# EAGLE design LeoPager (EAGLE 8.3.2)
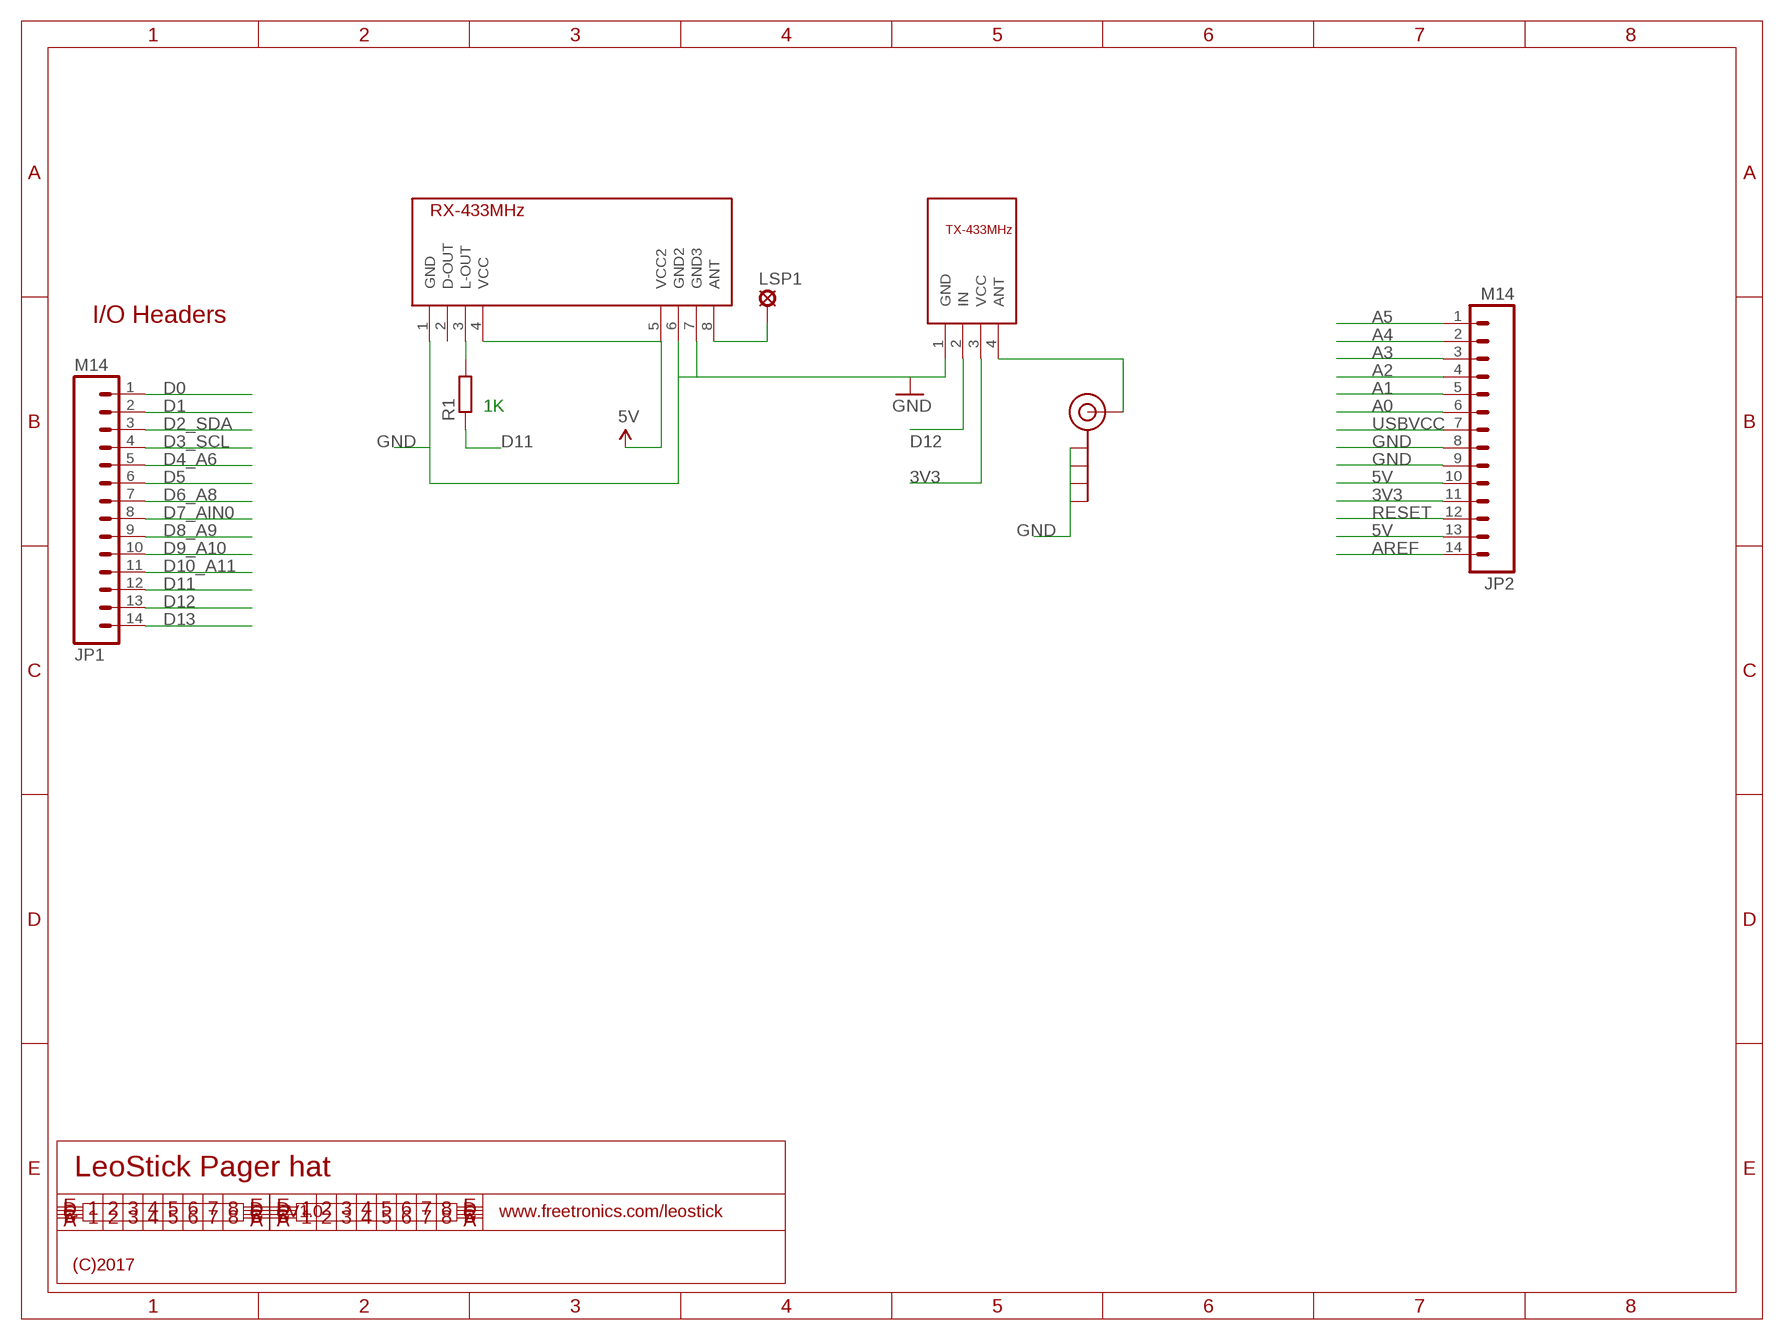
[diagram p0: schematic, sheet 1]

## Parts
J$1  SMA_EDGE  [SMA-EDGE]
JP1  M14  [1X14]
JP2  M14  [1X14]
LSP1  LSP10  [LSP10]
R1  R-EU_0204/7  [0204/7]
RF-MODULE1  RX-433MHZ  [RX-433MHZ]
RF-MODULE2  TX-433MHZ  [TX-433MHZ]

## Nets
3V3: JP2.11 RF-MODULE2.3(VCC)
5V: JP2.10 JP2.13 RF-MODULE1.4(VCC) RF-MODULE1.5(VCC2)
A0: JP2.6
A1: JP2.5
A2: JP2.4
A3: JP2.3
A4: JP2.2
A5: JP2.1
AREF: JP2.14
D0: JP1.1
D1: JP1.2
D2_SDA: JP1.3
D3_SCL: JP1.4
D4_A6: JP1.5
D5: JP1.6
D6_A8: JP1.7
D7_AIN0: JP1.8
D8_A9: JP1.9
D9_A10: JP1.10
D10_A11: JP1.11
D11: JP1.12 R1.1
D12: JP1.13 RF-MODULE2.2(IN)
D13: JP1.14
GND: J$1.GND@0(GND) J$1.GND@1(GND) J$1.GND@2(GND) J$1.GND@3(GND) JP2.8 JP2.9 RF-MODULE1.1(GND) RF-MODULE1.6(GND2) RF-MODULE1.7(GND3) RF-MODULE2.1(GND)
N$1: R1.2 RF-MODULE1.3(L-OUT)
N$2: J$1.SIG(SIGNAL) RF-MODULE2.4(ANT)
N$4: LSP1.MP RF-MODULE1.8(ANT)
RESET: JP2.12
USBVCC: JP2.7
Unconnected: RF-MODULE1.2(D-OUT)

## Notes on the sheet
- I/O Headers
- 1K
- LeoStick Pager hat
- . | V1.0 | www.freetronics.com/leostick
- (C)2017

## Library data of the parts
J$1 = SparkFun:SMA_EDGE: SMA Antenna Connector End launch SMA connector. The paste layer has been removed so that the connector can be hand soldered onto the board after reflow.
JP1 JP2 = freetronics-jon:M14: Header 14 Standard 14-pin 0.1" header. Use with straight break away headers (SKU : PRT-00116), right angle break away headers (PRT-00553), swiss pins (PRT-00743), machine pins (PRT-00117), and female headers (PRT-00115).
LSP1 = solpad:LSP10: SOLDER PAD drill 1.0 mm, distributor Buerklin, 12H555
R1 = resistor:R-EU_: RESISTOR, European symbol
RF-MODULE1 = LeoPager:RX-433MHZ: TX-433Mhz Receiver Module 433.92MHz
RF-MODULE2 = LeoPager:TX-433MHZ: TX-433Mhz Transmitter Module 433.92Mhz

## Net classes
0 default: width 0.152 mm, drill 0.241 mm, clearance 0.152 mm

## Board
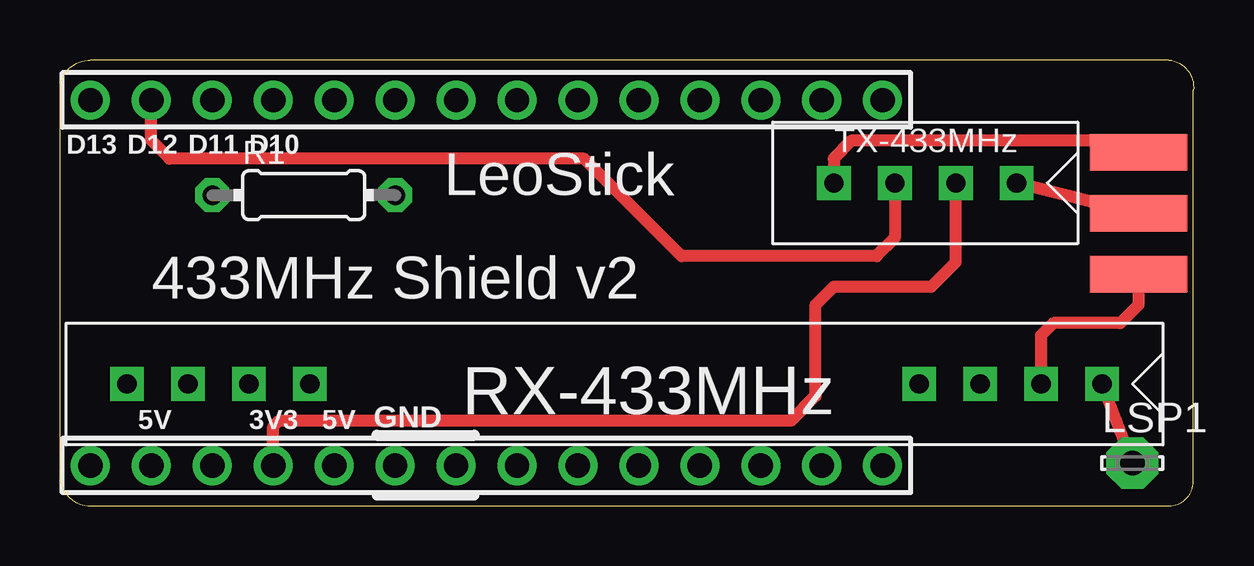
[diagram p1: board, top side]
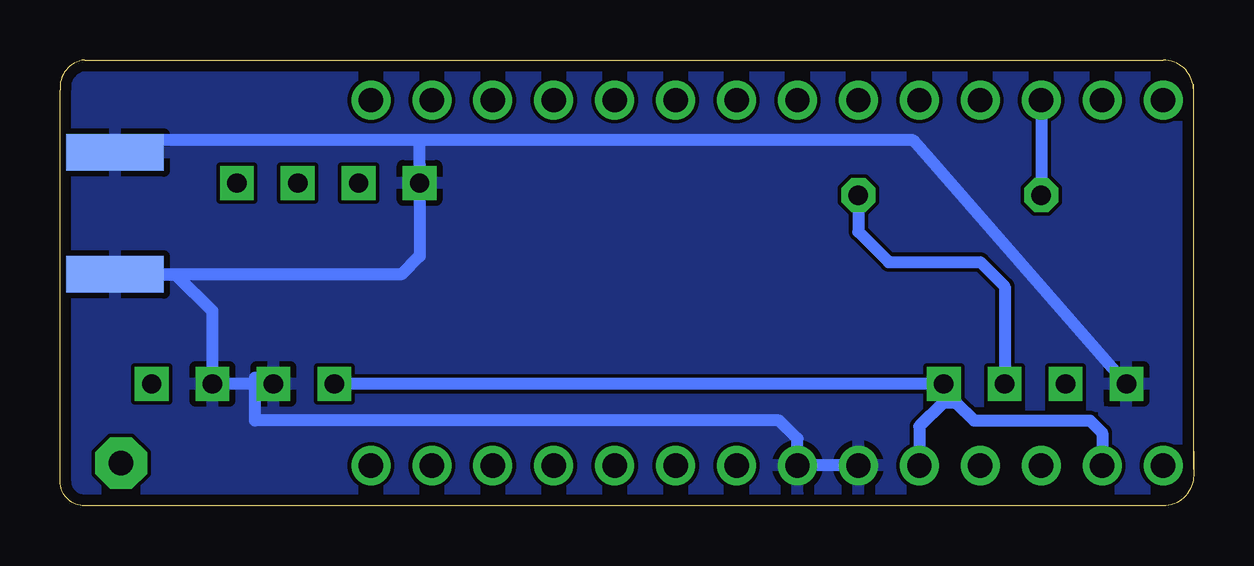
[diagram p2: board, bottom side, seen from below]

Size 47.25 x 18.59 mm. Coordinates in mm from the lower left corner, seen from the top.
Outline: 0,2.28 0,1.52
Outline: 0,1.52 0,1.27 arc90 1.27,0 46.23,0 arc90 47.24,1.02 47.24,17.32 arc90 46.23,18.59 1.27,18.59 arc90 0,17.32 0,16.32
Outline: 0,1.52 0,17.58
Copper layers (1*16): Top 0.035mm / dielectric 1.5mm / Bottom 0.035mm
Design rules "default *": minimum track width 6mil, minimum drill 9.5mil, track to track 6mil, track to pad 6mil, pad to pad 6mil, via to via 6mil, smd to smd 6mil, copper to edge 18mil, drill to drill 8mil, minimum pad ring 12mil, minimum via ring 4mil, stop-mask expansion 2mil, vias tented up to drill 25mil, thermal gap 10mil

### Footprints (pad centres in the part's own frame; a part is rotated, then mirrored left to right if it is on the bottom)
SMA-EDGE = smd 1.524 x 4.064: GND@0 0,0; GND@1 5.08,0; SIG 2.54,0 | smd 1.524 x 4.064 bottom: GND@2 0,0; GND@3 5.08,0
1X14 = drill 1.016: 1 0,0; 2 2.54,0; 3 5.08,0; 4 7.62,0; 5 10.16,0; 6 12.7,0; 7 15.24,0; 8 17.78,0; 9 20.32,0; 10 22.86,0; 11 25.4,0; 12 27.94,0; 13 30.48,0; 14 33.02,0
LSP10 = drill 1.016 pad 2.159 octagon: MP 0,0
0204/7 = drill 0.813 octagon: 1 -3.81,0; 2 3.81,0
RX-433MHZ = drill 0.8 square: 1 0,1.27; 2 2.54,1.27; 3 5.08,1.27; 4 7.62,1.27; 5 33.02,1.27; 6 35.56,1.27; 7 38.1,1.27; 8 40.64,1.27
TX-433MHZ = drill 0.8 square: 1 1.27,1.27; 2 3.81,1.27; 3 6.35,1.27; 4 8.89,1.27

### Placement (x,y rotation side)
J$1  44.96,9.65 90 top
JP1  34.29,16.92 180 top
JP2  34.29,1.68 180 top
LSP1  44.7,1.78 0 top
R1  10.16,12.95 0 top
RF-MODULE1  2.79,3.81 0 top
RF-MODULE2  30.99,12.19 0 top

### Tracks (layer width: path | path; a pad name or v marks a point on that pad's centre or on a via)
3V3
  Top 0.508: JP2.11 8.89,3.3 9.14,3.56 30.48,3.56 31.5,4.57 31.5,8.38 32.26,9.14 36.32,9.14 37.34,10.16 RF-MODULE2.3
5V
  Bottom 0.508: 10.41,4.32 RF-MODULE1.4 RF-MODULE1.5 | 10.41,4.32 11.43,3.3 JP2.10 | 10.41,4.32 9.91,4.32 9.14,3.56 4.32,3.56 3.81,3.05 JP2.13
D11
  Bottom 0.508: JP1.12 R1.1
D12
  Top 0.508: RF-MODULE2.2 34.8,11.18 34.04,10.41 25.91,10.41 21.84,14.48 4.57,14.48 3.81,15.24 JP1.13
GND
  Top 0.152: 44.96,9.6 J$1.GND@2 | RF-MODULE1.7 40.95,5.84 | 44.45,15.24 J$1.GND@3
  Top 0.508: J$1.GND@2 44.96,8.38 44.2,7.62 41.4,7.62 40.89,7.11 RF-MODULE1.7 | RF-MODULE2.1 32.26,14.48 33.02,15.24 44.45,15.24
  Bottom 0.152: 44.45,15.24 J$1.GND@3
  Bottom 0.508: 32.26,15.24 32.26,14.22 RF-MODULE2.1 32.26,10.41 33.02,9.65 J$1.GND@2 42.42,9.65 40.89,8.13 RF-MODULE1.7 RF-MODULE1.6 39.12,5.33 39.12,3.56 17.27,3.56 16.51,2.79 JP2.8 JP2.9 | RF-MODULE1.1 11.68,15.24 32.26,15.24 | 32.26,15.24 44.45,15.24
  pour Bottom: -1.02,19.3 -1.02,-0.76 -0.76,-1.02 46.48,-1.02 48.26,0.76 48.26,18.03 47.24,19.05 -0.76,19.05
N$1
  Bottom 0.508: R1.2 13.97,11.43 12.7,10.16 8.89,10.16 7.87,9.14 RF-MODULE1.3
N$2
  Top 0.508: J$1.SIG RF-MODULE2.4
N$4
  Top 0.508: RF-MODULE1.8 LSP1.MP

### Text on the board
tPlace: D13 | D12 | D11 | D10 | LeoStick | 433MHz Shield v2 | 5V | 3V3 | 5V | GND